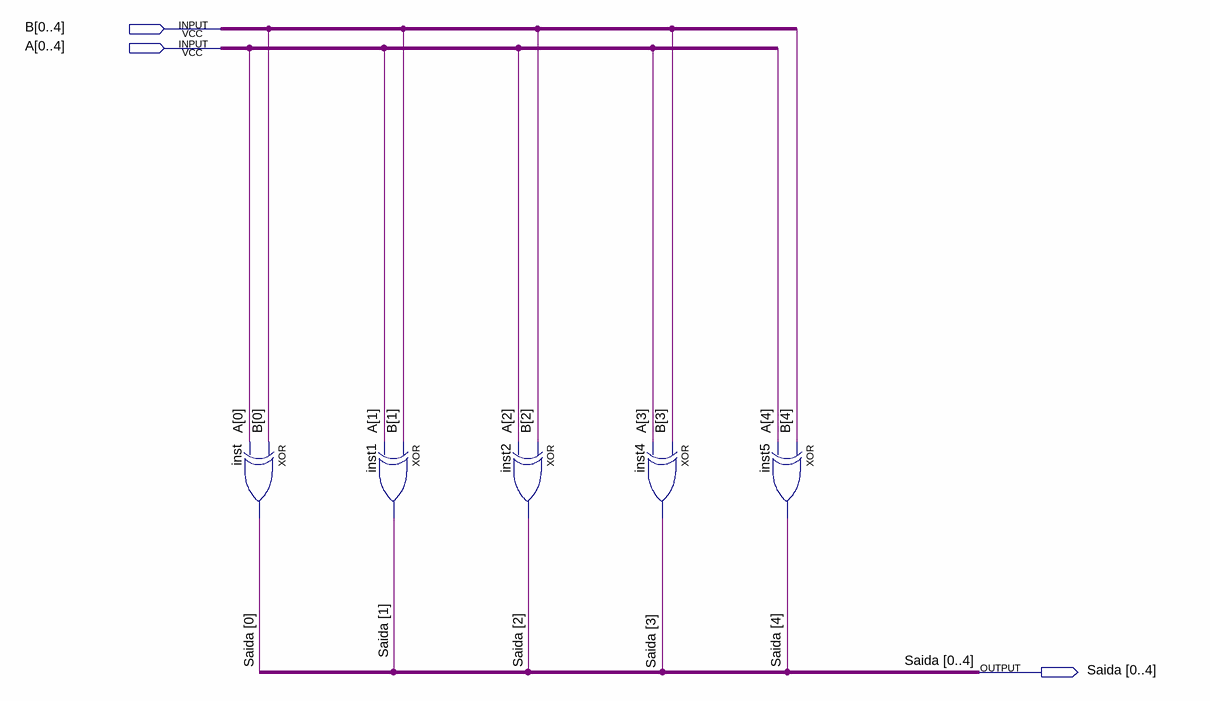
[diagram p0: schematic sheet]
// Quartus schematic AxorB.bdf as structural Verilog: 5 symbols, 3 pins
module AxorB (
  input  [0:4] B,
  input  [0:4] A,
  output [0:4] Saida
);

  xor inst (Saida[0], B[0], A[0]);
  xor inst1 (Saida[1], B[1], A[1]);
  xor inst2 (Saida[2], B[2], A[2]);
  xor inst4 (Saida[3], B[3], A[3]);
  xor inst5 (Saida[4], B[4], A[4]);
endmodule
